# EAGLE schematic BTRelays (EAGLE 6.3)
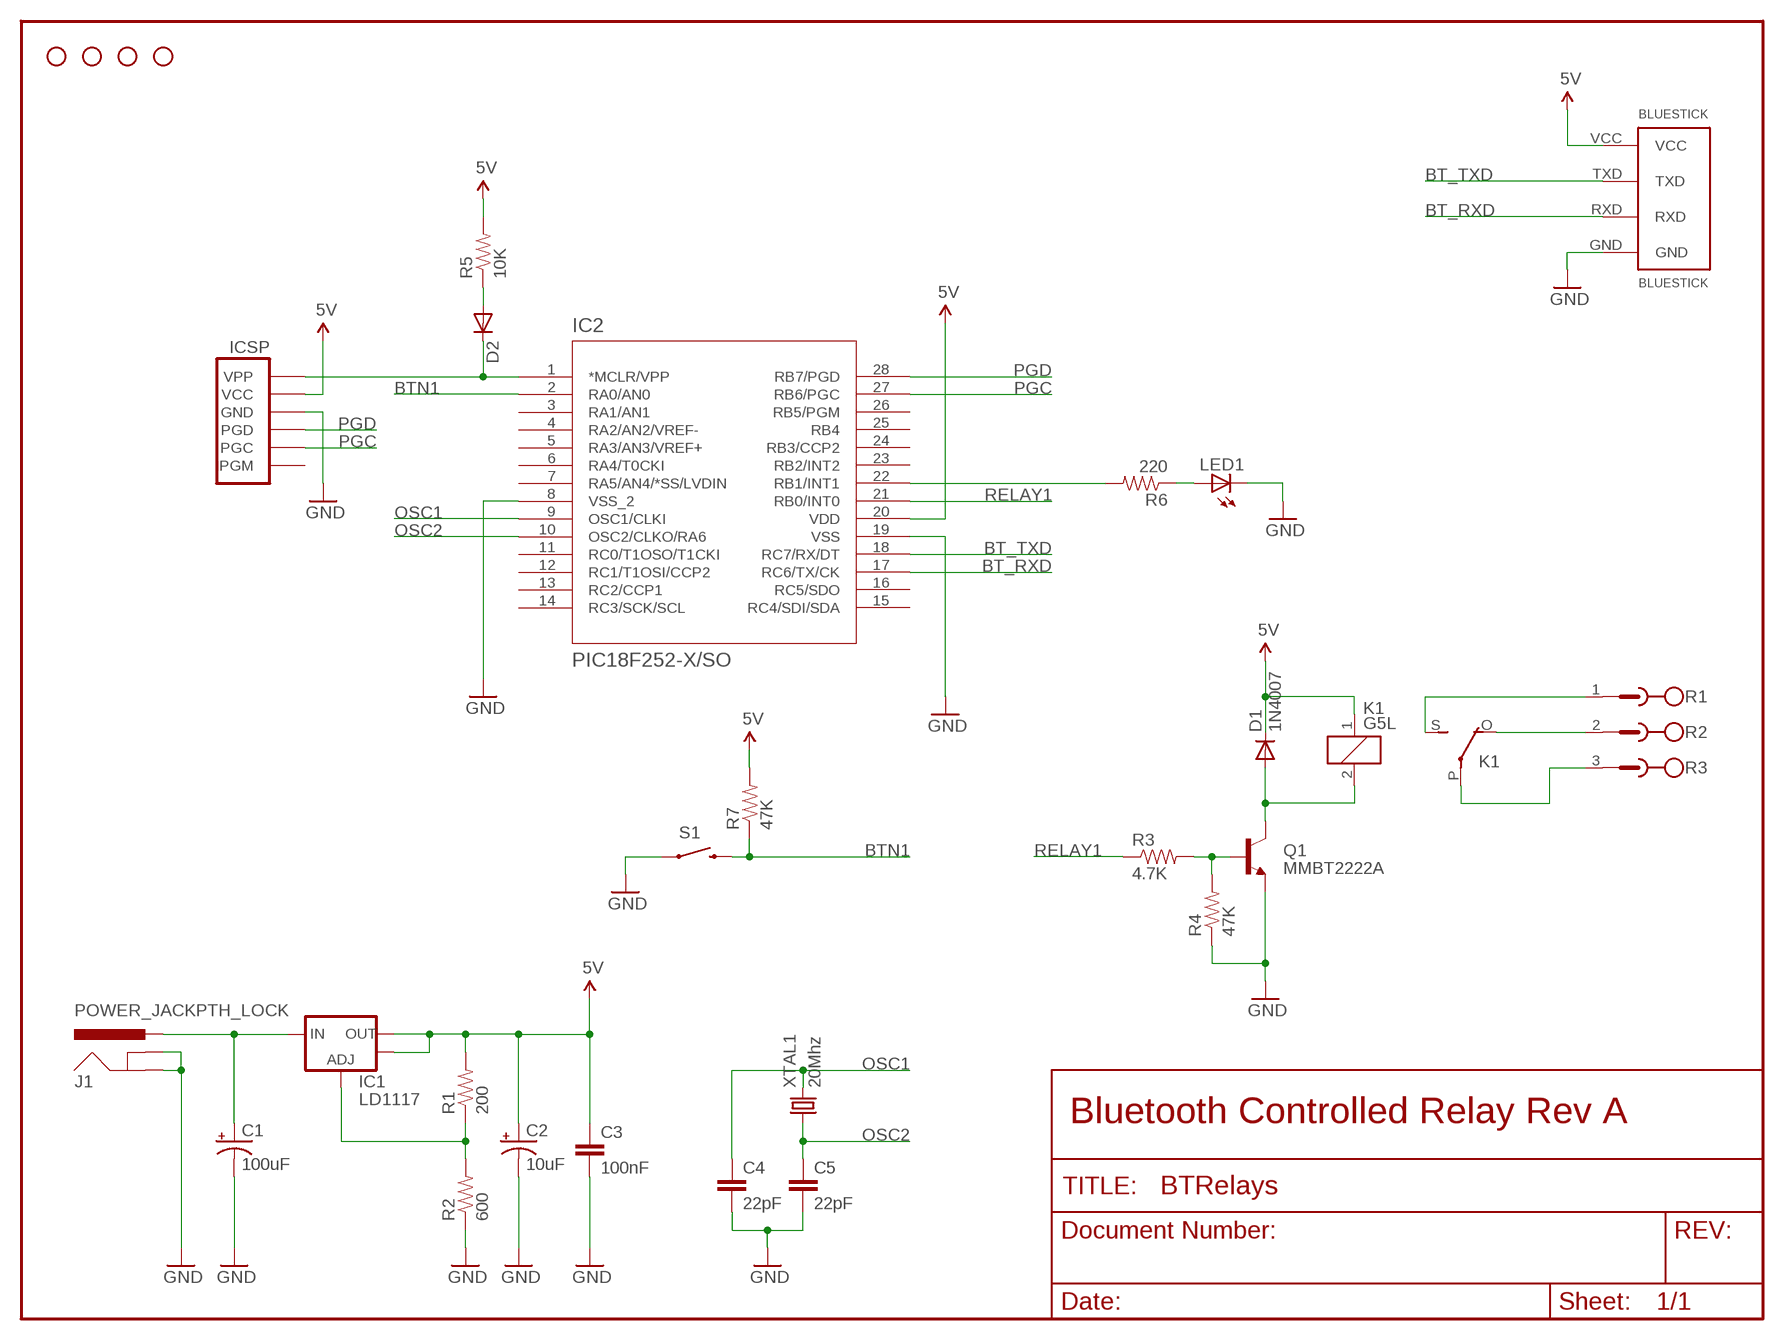
[diagram p0: schematic, sheet 1]

## Parts
BLUESTICK  BLUESTICK  [BLUESTICK-PTH]
C1  100uF  CAP_POLPTH1  [CPOL-RADIAL-100UF-25V]
C2  10uF  CAP_POL1206  [EIA3216]
C3  100nF  CAP1206  [1206]
C4  22pF  CAP1206  [1206]
C5  22pF  CAP1206  [1206]
D1  1N4007  DIODEPTH  [DIODE-1N4001]
D2  DIODESMA  [SMA-DIODE]
IC1  LD1117  V_REG_LM1117SOT223  [SOT223]
IC2  PIC18F252-X/SO  [SOIC28-W_MC]
ICSP  PIC-ICSPPOLAR_LOCK  [MOLEX-1X6_LOCK]
J1  POWER_JACKPTH_LOCK  [POWER_JACK_PTH_LOCK]
JP1  STAND-OFF  [STAND-OFF]
JP2  STAND-OFF  [STAND-OFF]
JP3  STAND-OFF  [STAND-OFF]
JP4  STAND-OFF  [STAND-OFF]
K1  G5L  [G5LE]
LED1  LED1206  [LED-1206]
Q1  MMBT2222A  TRANSISTOR_NPNSOT23  [SOT23]
R  MSTBV3  [MSTBV3]
R1  200  RESISTOR1206  [1206]
R2  600  RESISTOR1206  [1206]
R3  4.7K  RESISTOR1206  [1206]
R4  47K  RESISTOR1206  [1206]
R5  10K  RESISTOR1206  [1206]
R6  220  RESISTOR1206  [1206]
R7  47K  RESISTOR1206  [1206]
S1  SWITCH-MOMENTARY-2SMD  [TACTILE_SWITCH_SMD]
XTAL1  20Mhz  CRYSTALHC49US  [HC49US]

## Nets
5V: BLUESTICK.VCC C2.A(+) C3.1 D1.C IC1.2(OUT) IC1.4(OUT) IC2.20(VDD) ICSP.5(VCC) K1.1 R1.2 R5.2 R7.2
BT_RXD: BLUESTICK.RXD IC2.17(RC6/TX/CK)
BT_TXD: BLUESTICK.TXD IC2.18(RC7/RX/DT)
BTN1: IC2.2(RA0/AN0) R7.1 S1.3
GND: BLUESTICK.GND C1.2(-) C2.C(-) C3.2 C4.2 C5.2 IC2.8(VSS_2) IC2.19(VSS) ICSP.4(GND) J1.GND J1.GNDBREAK LED1.C Q1.2(E) R2.1 R4.1 S1.1
N$1: C1.1(+) IC1.3(IN) J1.PWR
N$2: IC1.1(ADJ) R1.1 R2.2
N$3: Q1.1(B) R3.2 R4.2
N$4: D1.A K1.2 Q1.3(C)
N$5: K1.P(2:P) R.3
N$6: K1.O(2:O) R.2
N$7: K1.S(2:S) R.1
N$8: D2.C IC2.1(*MCLR/VPP) ICSP.6(VPP)
N$9: D2.A R5.1
N$10: LED1.A R6.1
N$11: IC2.22(RB1/INT1) R6.2
OSC1: C4.1 IC2.9(OSC1/CLKI) XTAL1.2
OSC2: C5.1 IC2.10(OSC2/CLKO/RA6) XTAL1.1
PGC: IC2.27(RB6/PGC) ICSP.2(PGC)
PGD: IC2.28(RB7/PGD) ICSP.3(PGD)
RELAY1: IC2.21(RB0/INT0) R3.1
Unconnected: IC2.3(RA1/AN1) IC2.4(RA2/AN2/VREF-) IC2.5(RA3/AN3/VREF+) IC2.6(RA4/T0CKI) IC2.7(RA5/AN4/*SS/LVDIN) IC2.11(RC0/T1OSO/T1CKI) IC2.12(RC1/T1OSI/CCP2) IC2.13(RC2/CCP1) IC2.14(RC3/SCK/SCL) IC2.15(RC4/SDI/SDA) IC2.16(RC5/SDO) IC2.23(RB2/INT2) IC2.24(RB3/CCP2) IC2.25(RB4) IC2.26(RB5/PGM) ICSP.1(PGM)

## Notes on the sheet
- Bluetooth Controlled Relay Rev A

## Library data of the parts
BLUESTICK = andy:BLUESTICK
C1 C2 = SparkFun:CAP_POL: Capacitor Polarized These are standard SMD and PTH capacitors. Normally 10uF, 47uF, and 100uF in electrolytic and tantalum varieties. Always verify the external diameter of the through hole cap, it varies with capacity, voltage, and manufacturer. The EIA devices should be standard.
C3-C5 = SparkFun:CAP: Capacitor Standard 0603 ceramic capacitor, and 0.1" leaded capacitor.
D1 D2 = SparkFun:DIODE: Diode These are standard reverse protection diodes and small signal diodes. SMA package can handle up to about 1A. SOD-323 can handle about 200mA. What the SOD-323 package when ordering, there are some mfgs out there that are 5-pin packages.
IC1 = SparkFun:V_REG_LM1117: Voltage Regulator LM1117 Standard adjustable voltage regulator but in SMD form. Spark Fun Electronics SKU : COM-00595
IC2 = andy:PIC18F252-X/SO
ICSP = SparkFun:PIC-ICSP: ISCP Programming connector for UAV, UBW Kit, etc.
J1 = SparkFun:POWER_JACK: Power Jack This is the standard 5.5mm barrel jack for power. The PTH is the most common, proven, reliable, footprint. All others are experimental. The Slot footprint only works if the mill layer is transmitted to the PCB fab house so be warned. Spark Fun Electronics SKU : PRT-00119. Mating wall wart : TOL-00298 (and others)
JP1-JP4 = SparkFun:STAND-OFF: Stand Off This is the mechanical footprint for a #4 phillips button head screw. Use the keepout ring to avoid running the screw head into surrounding components. SKU : PRT-00447
K1 = relay:G5L: RELAY 1 x switch, 10 A/120 V AC, 8 A/30 V ADC, Omron
LED1 = SparkFun:LED: LEDs Standard schematic elements and footprints for 5mm, 3mm, 1206, and 0603 sized LEDs. 5mm - Spark Fun Electronics SKU : COM-00529 (and others)
Q1 = SparkFun:TRANSISTOR_NPN: Transistor NPN BJT configuration in SOT23 package. MMBT2222 is the common NPN we use. Double check BCE configuration again layout.
R = andy:MSTBV3
R1-R7 = SparkFun:RESISTOR: Resistor Basic schematic elements and footprints for 0603, 1206, and PTH resistors.
S1 = SparkFun:SWITCH-MOMENTARY-2
XTAL1 = SparkFun:CRYSTAL: Crystals Various standard crystals. Proven footprints. Spark Fun Electronics SKU : COM-00534